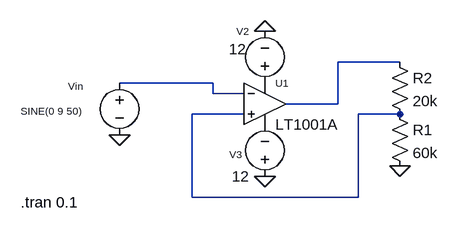
[diagram p0: schematic 03.schmitt trigger.asc]
03.schmitt trigger.asc, the LTspice schematic file:
Version 4
SHEET 1 880 680
WIRE 160 -32 64 -32
WIRE -128 0 -272 0
WIRE -128 16 -128 0
WIRE -80 16 -128 16
WIRE 64 32 64 -32
WIRE 64 32 -16 32
WIRE -80 48 -160 48
WIRE 160 48 96 48
WIRE -160 176 -160 48
WIRE 96 176 96 48
WIRE 96 176 -160 176
FLAG -272 80 0
FLAG -48 144 0
FLAG -48 -80 0
FLAG 160 128 0
SYMBOL OpAmps\\LT1001A -48 -32 R0
WINDOW 0 16 32 Left 1
SYMATTR InstName U1
SYMBOL res 144 32 R0
SYMATTR InstName R1
SYMATTR Value 60k
SYMBOL res 144 -48 R0
SYMATTR InstName R2
SYMATTR Value 20k
SYMBOL voltage -272 -16 R0
WINDOW 0 -79 21 Left 1
WINDOW 3 -152 59 Left 1
WINDOW 123 0 0 Left 0
WINDOW 39 0 0 Left 0
SYMATTR InstName Vin
SYMATTR Value SINE(0 9 50)
SYMBOL voltage -48 16 R180
WINDOW 0 24 96 Left 1
WINDOW 3 28 68 Left 2
WINDOW 123 0 0 Left 0
WINDOW 39 0 0 Left 0
SYMATTR InstName V2
SYMATTR Value 12
SYMBOL voltage -48 160 R180
WINDOW 0 35 50 Left 1
WINDOW 3 24 16 Left 2
WINDOW 123 0 0 Left 0
WINDOW 39 0 0 Left 0
SYMATTR InstName V3
SYMATTR Value 12
TEXT -424 184 Left 2 !.tran 0.1

The netlist it stands for:
* 03.schmitt trigger.asc
XU1 N003 N002 P001 P002 N001 LT1001  ; LT1001A, pins In+ In- V+ V- OUT
R1 N003 0 60k
R2 N001 N003 20k
Vin N002 0 SINE(0 9 50)
V2 P001 0 12
V3 0 P002 12
.tran 0.1
.lib LTC.lib
.backanno
.end